# EAGLE design outdoor_module (EAGLE 9.6.2)
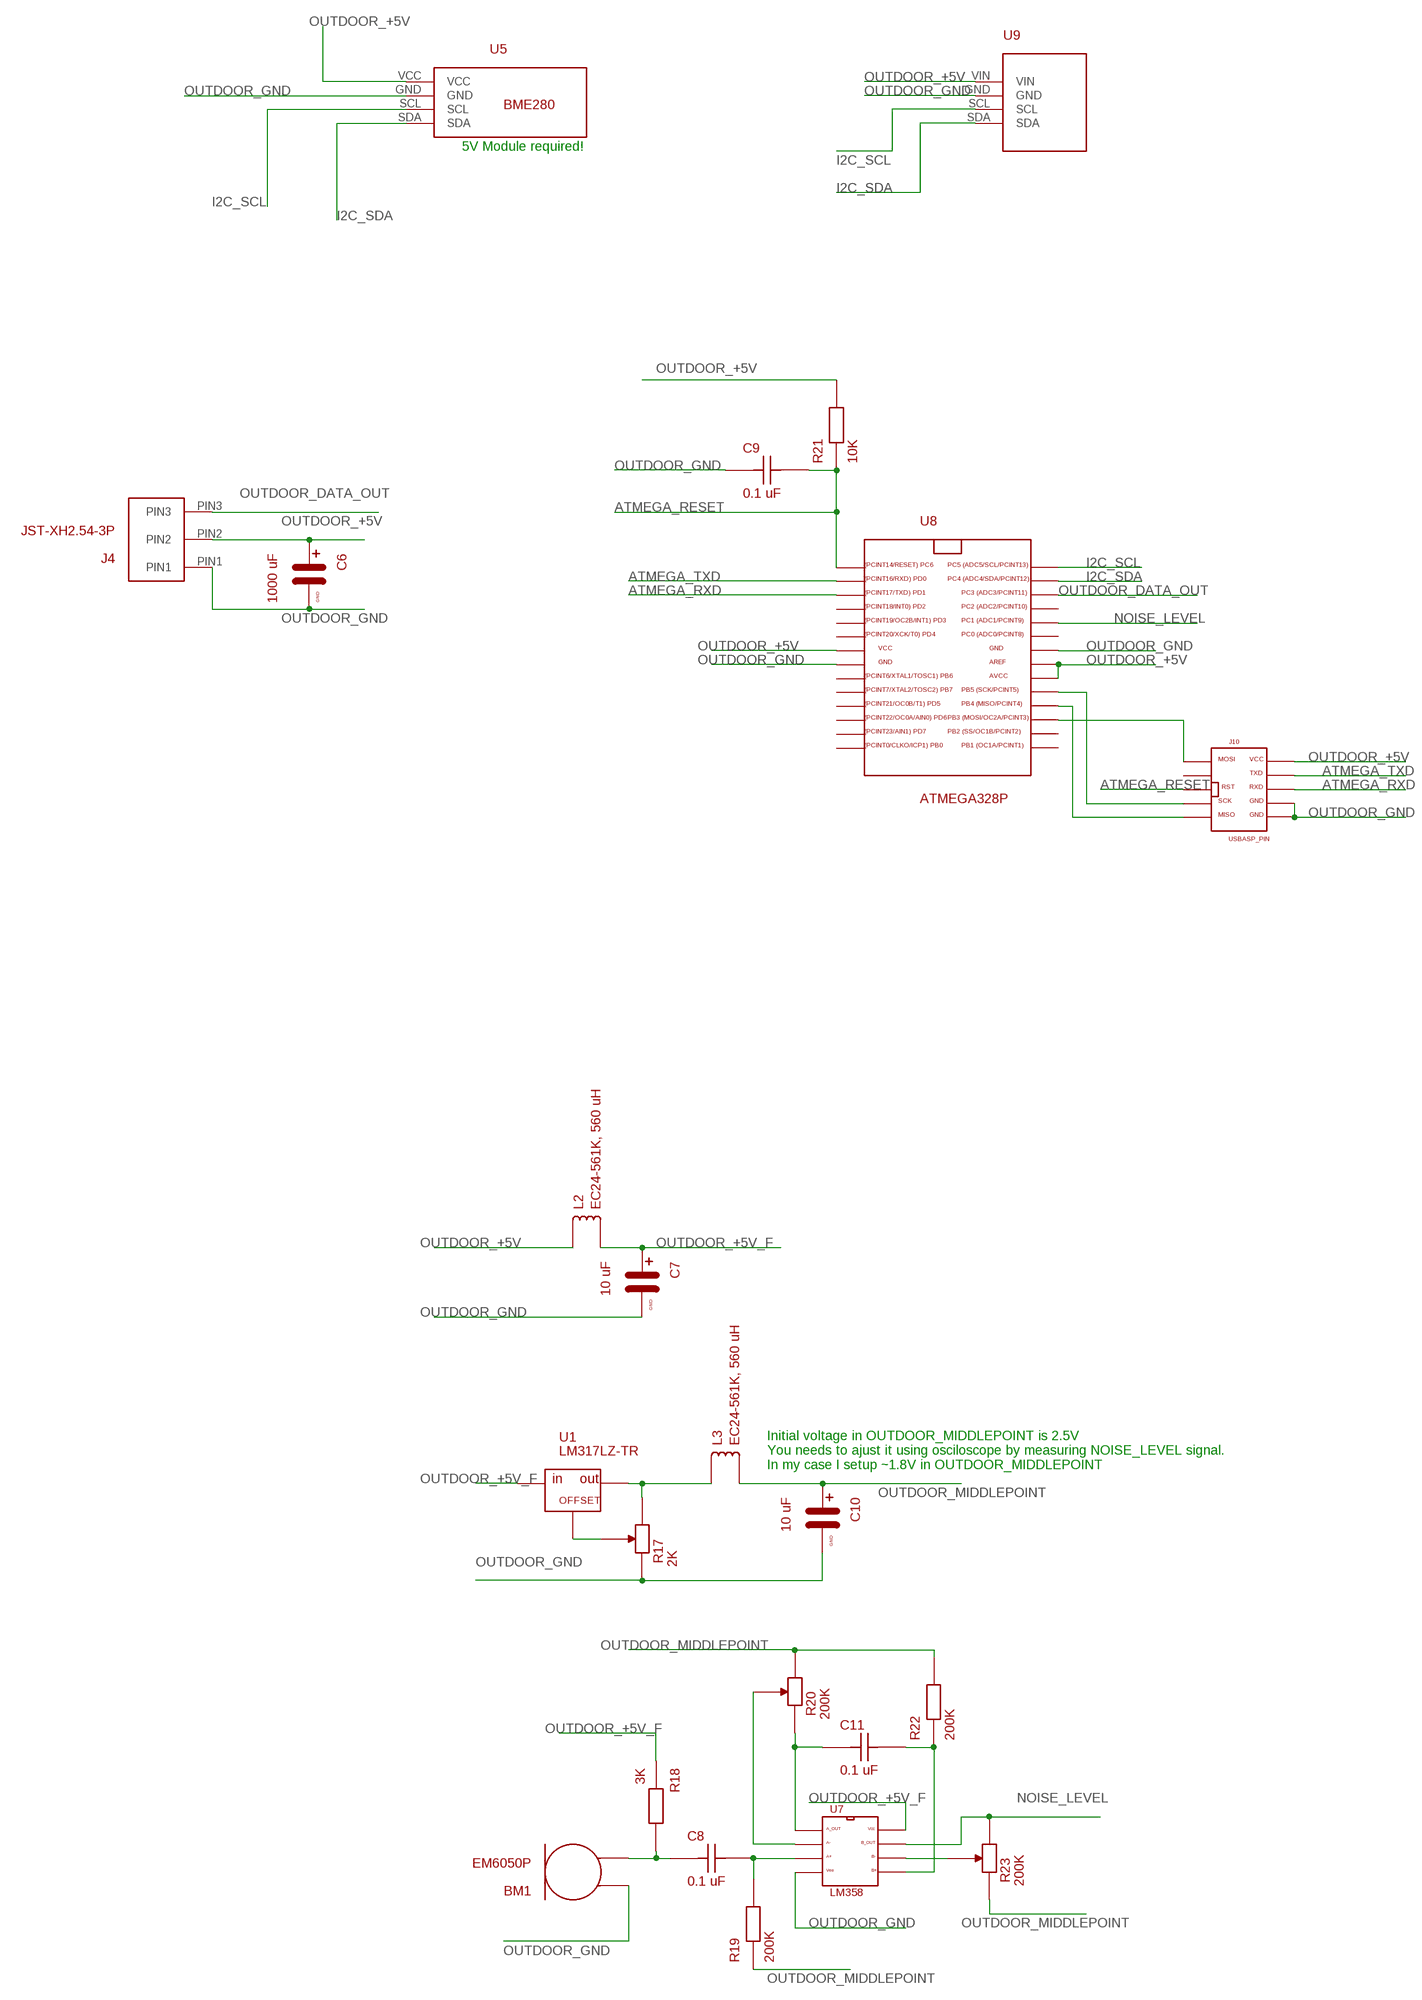
[diagram p0: schematic, sheet 1]

## Parts
BM1  EM6050P  MICROPHONE  [MICROPHONE]
C6  1000 uF  C  [C]
C7  10 uF  C  [C]
C8  0.1 uF  C-1  [C-1]
C9  0.1 uF  C-1  [C-1]
C10  10 uF  C  [C]
C11  0.1 uF  C-1  [C-1]
J4  JST-XH2.54-3P  JST-XH254-3P  [JST-XH254-3P]
J10  USBASP_PIN  [USBASP_PIN]
L2  EC24-561K, 560 uH  LL-EC24  [L-EC24]
L3  EC24-561K, 560 uH  LL-EC24  [L-EC24]
R17  2K  RD  [RD-3362H]
R18  3K  R  [R]
R19  200K  R  [R]
R20  200K  RD3296-Z  [RD-3296Z]
R21  10K  R  [R]
R22  200K  R  [R]
R23  200K  RD3296-Z  [RD-3296Z]
U1  LM317LZ-TR  LM317L  [TO-92]
U5  BMP280 5V module  BME280BME280-CONNECTOR-ONLY  [BME280-CONNECTOR-ONLY]
U7  LM358  [DIP8]
U8  ATMEGA328P  [ATMEGA328P]
U9  GY-SGP30  [GY-SGP30]

## Nets
ATMEGA_RESET: C9.P$2 J10.RST(RESET) R21.P$1 U8.PC6
ATMEGA_RXD: J10.RXD U8.PD1
ATMEGA_TXD: J10.TXD U8.PD0
I2C_SCL: U5.SCL U8.PC5 U9.SCL
I2C_SDA: U5.SDA U8.PC4 U9.SDA
N$14: BM1.P$2 C8.P$1 R18.P$2
N$15: C8.P$2 R19.P$2 U7.PIN_3(A+)
N$17: R17.P3 U1.P3(GND)
N$18: C11.P$1 R20.P1 U7.PIN_1(A_OUT)
N$19: R23.P3 U7.PIN_6(B-)
N$20: C11.P$2 R22.P$1 U7.PIN_5(B+)
N$21: R20.P3 U7.PIN_2(A-)
N$24: J10.MOSI U8.PB3
N$25: J10.MISO U8.PB4
N$26: J10.SCK U8.PB5
NOISE_LEVEL: R23.P2 U7.PIN_7(B_OUT) U8.PC1
OUT: L3.P$1 R17.P2 U1.P2(OUT)
OUTDOOR_+5V: C6.PIN_PLUS J4.PIN2 J10.VCC L2.P$1 R21.P$2 U5.VCC U8.AREF U8.AVCC U8.VCC U9.VIN
OUTDOOR_+5V_F: C7.PIN_PLUS L2.P$2 R18.P$1 U1.P1(IN) U7.PIN_8(VCC)
OUTDOOR_DATA_OUT: J4.PIN3 U8.PC3
OUTDOOR_GND: BM1.P$1 C6.PIN_GND C7.PIN_GND C9.P$1 C10.PIN_GND J4.PIN1 J10.GND J10.GND1 R17.P1 U5.GND U7.PIN_4(VEE) U8.GND U8.GND1 U9.GND
OUTDOOR_MIDDLEPOINT: C10.PIN_PLUS L3.P$2 R19.P$1 R20.P2 R22.P$2 R23.P1
Unconnected: J10.NC1 U8.PB0 U8.PB1 U8.PB2 U8.PB6 U8.PB7 U8.PC0 U8.PC2 U8.PD2 U8.PD3 U8.PD4 U8.PD5 U8.PD6 U8.PD7

## Notes on the sheet
- 5V Module required!
- Initial voltage in OUTDOOR_MIDDLEPOINT is 2.5V
  You needs to ajust it using osciloscope by measuring NOISE_LEVEL signal.
  In my case I setup ~1.8V in OUTDOOR_MIDDLEPOINT

## Library data of the parts
BM1 = my_devices:MICROPHONE
C6 C7 C10 = my_devices:C
C8 C9 C11 = my_devices:C-1
J4 = my_devices:JST-XH254-3P
J10 = my_devices:USBASP_PIN
L2 L3 = my_devices:L
R17 R20 R23 = my_devices:RD
R18 R19 R21 R22 = my_devices:R
U1 = my_devices:LM317L
U5 = my_devices:BME280
U7 = my_devices:LM358
U8 = my_devices:ATMEGA328P
U9 = my_devices:GY-SGP30

## Board
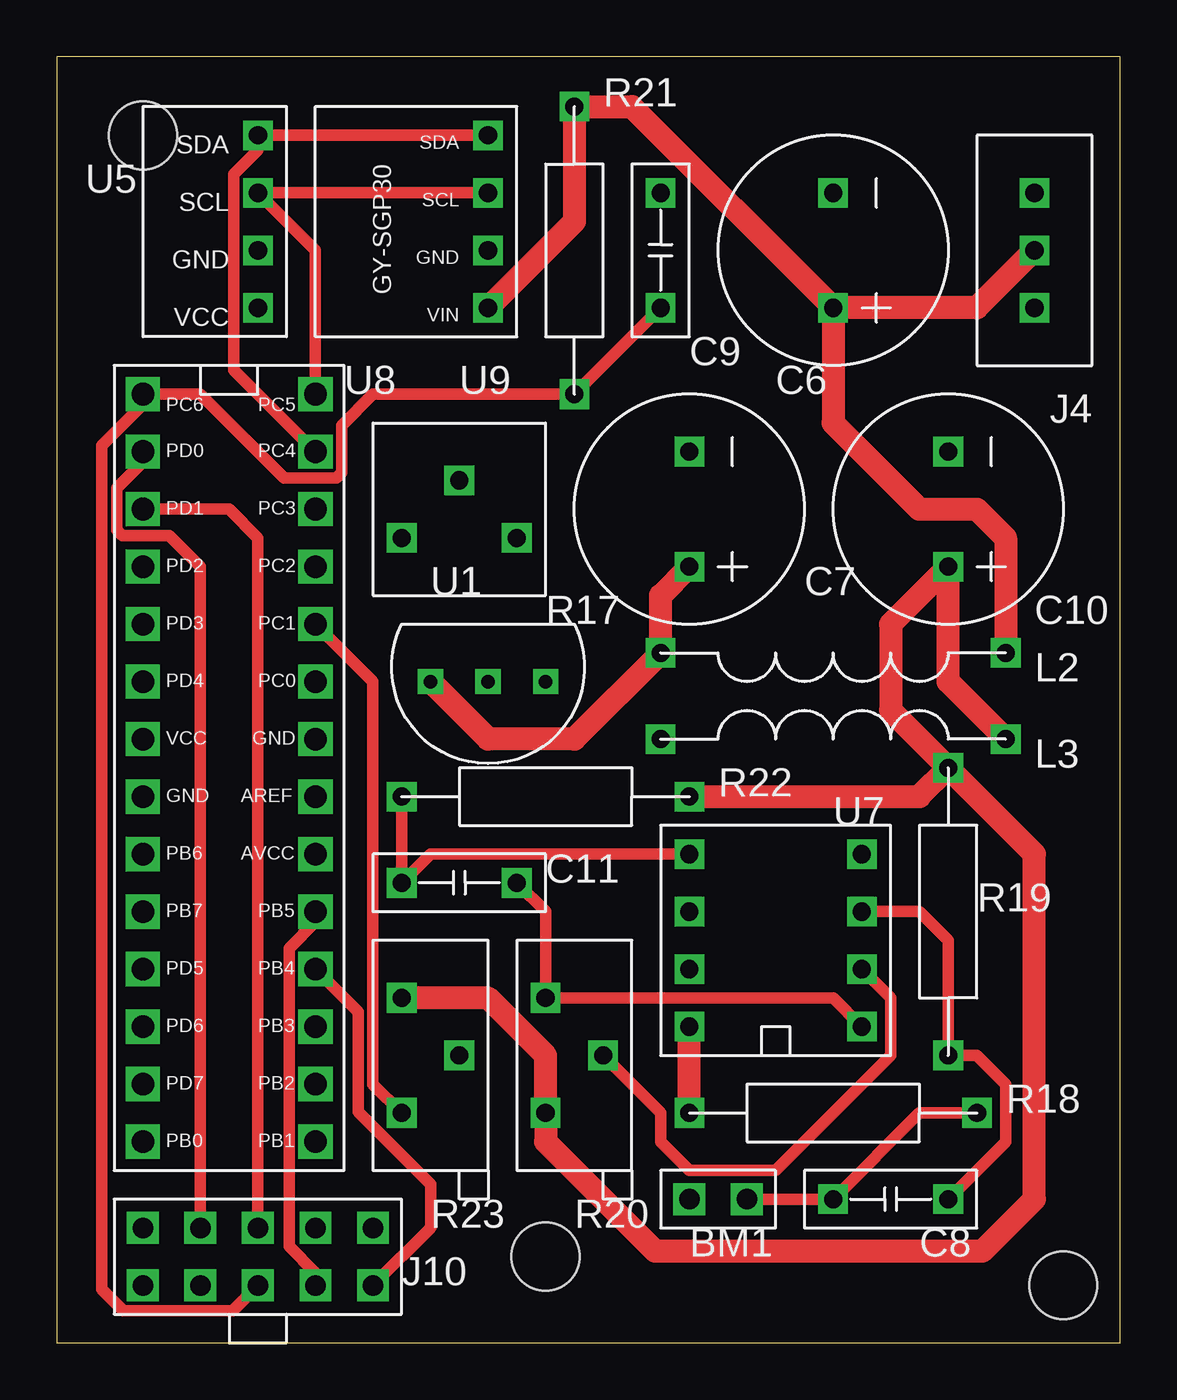
[diagram p1: board, top side]
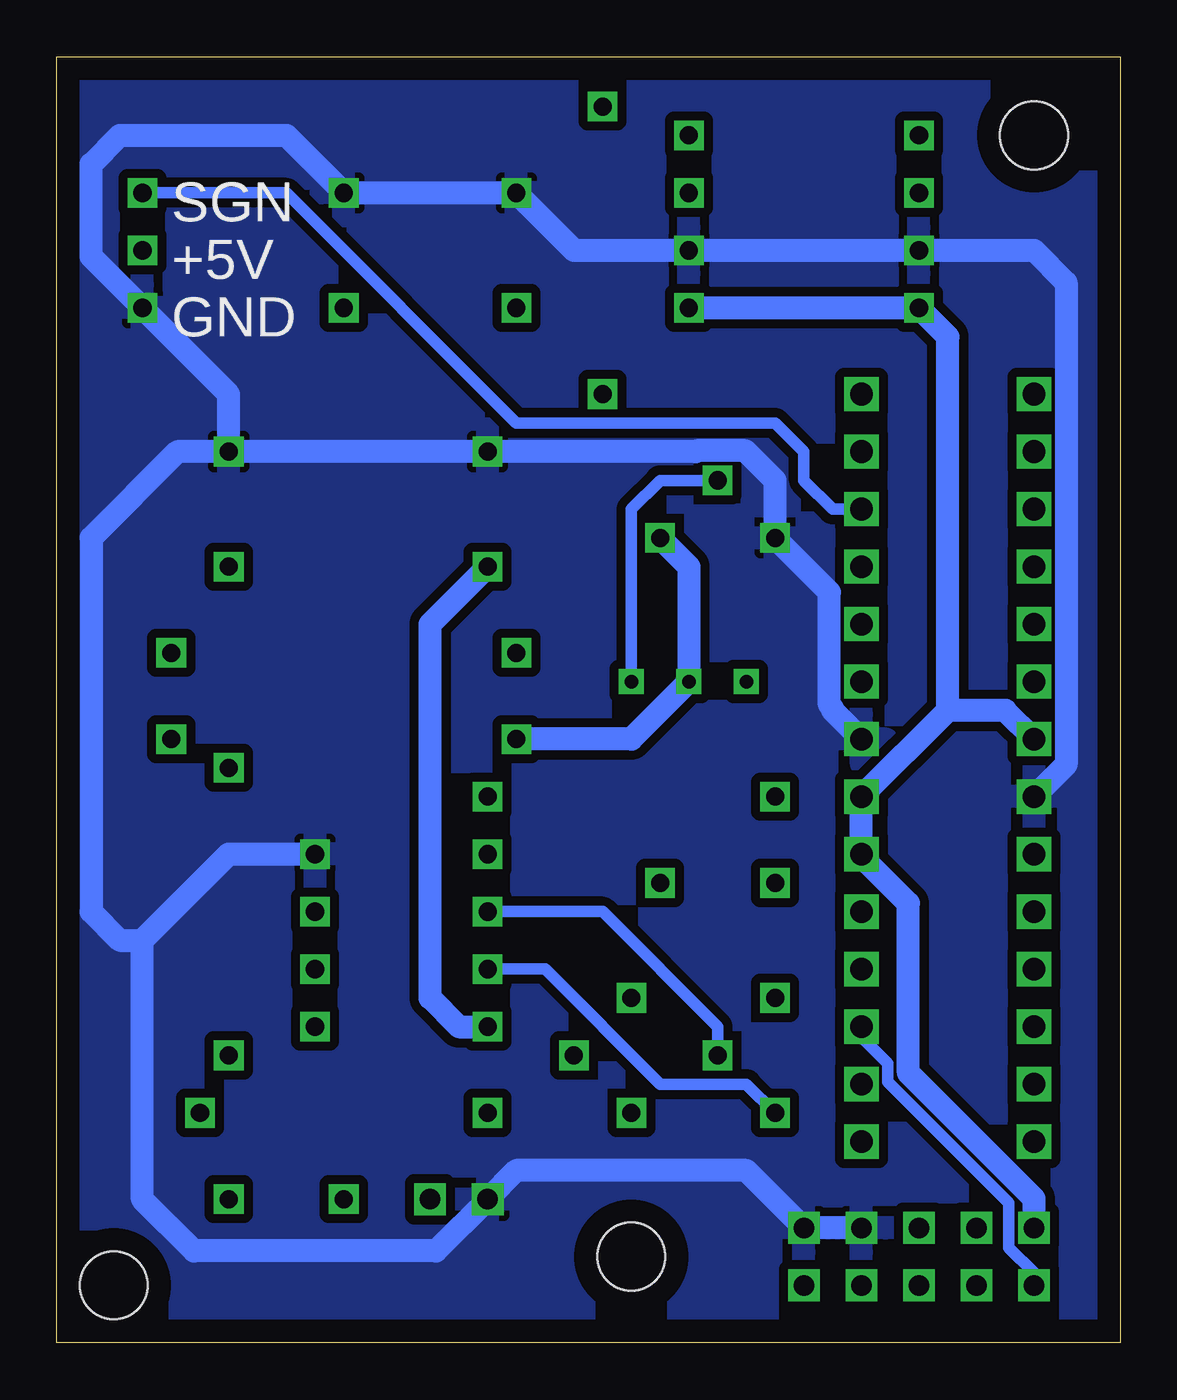
[diagram p2: board, bottom side, seen from below]

Size 46.97 x 56.82 mm. Coordinates in mm from the lower left corner, seen from the top.
Outline: 0,0 46.97,0 46.97,56.82 0,56.82 0,0
Copper layers (1*16): Top 0.035mm / dielectric 1.5mm / Bottom 0.035mm
Design rules "default": minimum track width 6mil, minimum drill 0.35mm, track to track 6mil, track to pad 6mil, pad to pad 6mil, via to via 6mil, smd to smd 6mil, copper to edge 40mil, drill to drill 6mil, minimum pad ring 10mil, minimum via ring 8mil, stop-mask expansion 4mil, vias tented up to drill 0mil, thermal gap 10mil
Holes 3 mm at 3.81,53.34 44.45,2.54 21.59,3.81

### Footprints (pad centres in the part's own frame; a part is rotated, then mirrored left to right if it is on the bottom)
MICROPHONE = drill 0.9 square: P$1 -1.27,0; P$2 1.27,0
C = drill 0.8 square: PIN_GND 2.54,0; PIN_PLUS -2.54,0
C-1 = drill 0.8 square: P$1 -2.54,0; P$2 2.54,0
JST-XH254-3P = drill 0.8 square: PIN1 -2.54,0; PIN2 0,0; PIN3 2.54,0
USBASP_PIN = drill 0.9 square: GND 1.27,-2.54; GND1 1.27,-5.08; MISO -1.27,-5.08; MOSI -1.27,5.08; NC1 -1.27,2.54; RST -1.27,0; RXD 1.27,0; SCK -1.27,-2.54; TXD 1.27,2.54; VCC 1.27,5.08
L-EC24 = drill 0.8 square: P$1 -7.62,0; P$2 7.62,0
RD-3362H = drill 0.8 square: P1 -2.54,-1.27; P2 2.54,-1.27; P3 0,1.27
R = drill 0.8 square: P$1 -6.35,0; P$2 6.35,0
RD-3296Z = drill 0.8 square: P1 -2.54,0; P2 2.54,0; P3 0,2.54
TO-92 = drill 0.6 square: P1 -2.54,0; P2 0,0; P3 2.54,0
BME280-CONNECTOR-ONLY = drill 0.8 square: GND -5.08,1.27; SCL -5.08,-1.27; SDA -5.08,-3.81; VCC -5.08,3.81
DIP8 = drill 0.8 square: PIN_1 -3.81,3.81; PIN_2 -3.81,1.27; PIN_3 -3.81,-1.27; PIN_4 -3.81,-3.81; PIN_5 3.81,-3.81; PIN_6 3.81,-1.27; PIN_7 3.81,1.27; PIN_8 3.81,3.81
ATMEGA328P = drill 1 square: AREF 3.81,-2.54; AVCC 3.81,-5.08; GND -3.81,-2.54; GND1 3.81,0; PB0 -3.81,-17.78; PB1 3.81,-17.78; PB2 3.81,-15.24; PB3 3.81,-12.7; PB4 3.81,-10.16; PB5 3.81,-7.62; PB6 -3.81,-5.08; PB7 -3.81,-7.62; PC0 3.81,2.54; PC1 3.81,5.08; PC2 3.81,7.62; PC3 3.81,10.16; PC4 3.81,12.7; PC5 3.81,15.24; PC6 -3.81,15.24; PD0 -3.81,12.7; PD1 -3.81,10.16; PD2 -3.81,7.62; PD3 -3.81,5.08; PD4 -3.81,2.54; PD5 -3.81,-10.16; PD6 -3.81,-12.7; PD7 -3.81,-15.24; VCC -3.81,0
GY-SGP30 = drill 0.8 square: GND 0,1.27; SCL 0,-1.27; SDA 0,-3.81; VIN 0,3.81

### Placement (x,y rotation side)
BM1  29.21,6.35 0 top
C6  34.29,48.26 90 top
C7  27.94,36.83 90 top
C8  36.83,6.35 0 top
C9  26.67,48.26 270 top
C10  39.37,36.83 90 top
C11  17.78,20.32 180 top
J4  43.18,48.26 90 top
J10  8.89,3.81 90 top
L2  34.29,30.48 180 top
L3  34.29,26.67 0 top
R17  17.78,36.83 0 top
R18  34.29,10.16 0 top
R19  39.37,19.05 270 top
R20  21.59,12.7 270 top
R21  22.86,48.26 90 top
R22  21.59,24.13 0 top
R23  15.24,12.7 270 top
U1  19.05,29.21 0 top
U5  3.81,49.53 180 top
U7  31.75,17.78 180 top
U8  7.62,26.67 0 top
U9  19.05,49.53 180 top

### Tracks (layer width: path | path; a pad name or v marks a point on that pad's centre or on a via)
ATMEGA_RESET
  Top 0.508: C9.P$2 R21.P$1 13.97,41.91 12.59,40.53 12.59,38.45 12.35,38.21 10.05,38.21 6.35,41.91 U8.PC6 3.81,41.45 1.99,39.63 1.99,2.38 2.94,1.43 7.78,1.43 J10.RST
ATMEGA_RXD
  Top 0.508: U8.PD1 7.62,36.83 8.89,35.56 J10.RXD
ATMEGA_TXD
  Top 0.508: J10.TXD 6.35,30.48 6.35,31.75 6.35,34.29 4.97,35.67 2.89,35.67 2.65,35.91 2.65,37.75 3.81,38.91 U8.PD0
I2C_SCL
  Top 0.508: U8.PC5 11.43,48.26 U5.SCL U9.SCL
I2C_SDA
  Top 0.508: U8.PC4 7.83,42.97 7.83,51.62 8.89,52.68 U5.SDA U9.SDA
N$14
  Top 0.508: BM1.P$2 C8.P$1 38.1,10.16 R18.P$2
N$15
  Top 0.508: C8.P$2 41.91,8.89 41.91,11.43 40.64,12.7 R19.P$2 39.37,17.78 38.1,19.05 U7.PIN_3
N$17
  Bottom 0.508: R17.P3 20.32,38.1 21.59,36.83 U1.P3
N$18
  Top 0.508: C11.P$1 21.59,19.05 R20.P1 34.29,15.24 U7.PIN_1
N$19
  Bottom 0.508: R23.P3 17.78,13.97 22.86,19.05 U7.PIN_6
N$20
  Top 0.508: R22.P$1 C11.P$2 16.51,21.59 U7.PIN_5
N$21
  Top 0.508: R20.P3 26.67,10.16 26.67,8.89 27.94,7.62 31.75,7.62 36.83,12.7 36.83,15.24 U7.PIN_2
N$24
  Bottom 0.508: J10.MOSI 3.81,3.1 4.92,4.21 4.92,6.19 10.27,11.54 10.27,12.35 11.43,13.51 U8.PB3
N$25
  Top 0.508: J10.MISO 16.51,5.08 16.51,7.01 13.31,10.21 13.31,14.63 U8.PB4
N$26
  Top 0.508: J10.SCK 11.43,3.1 10.27,4.26 10.27,17.43 11.43,18.59 U8.PB5
NOISE_LEVEL
  Top 0.508: R23.P2 13.97,11.43 13.97,29.21 U8.PC1
  Bottom 0.508: R23.P2 16.51,11.43 20.32,11.43 25.4,16.51 U7.PIN_7
OUT
  Bottom 1.016: L3.P$1 21.59,26.67 U1.P2 19.05,34.29 R17.P2
OUTDOOR_+5V
  Top 1.016: J4.PIN2 40.64,45.72 C6.PIN_PLUS | L2.P$1 41.91,35.56 40.64,36.83 38.1,36.83 34.29,40.64 C6.PIN_PLUS | U9.VIN 22.86,49.53 R21.P$2 25.4,54.61 C6.PIN_PLUS
  Bottom 1.016: U9.VIN U5.VCC 7.62,44.45 7.62,27.94 | 7.62,27.94 U8.AREF U8.AVCC 11.43,21.49 9.36,19.42 9.36,11.92 3.81,6.37 J10.VCC | U8.VCC 5.08,27.94 7.62,27.94
OUTDOOR_+5V_F
  Top 1.016: R18.P$1 U7.PIN_8 | C7.PIN_PLUS 26.67,33.02 L2.P$2 22.86,26.67 19.05,26.67 U1.P1
  Bottom 1.016: U7.PIN_8 29.21,13.97 30.48,15.24 30.48,31.75 C7.PIN_PLUS
OUTDOOR_DATA_OUT
  Bottom 0.508: U8.PC3 12.7,36.83 13.97,38.1 13.97,39.37 15.24,40.64 26.67,40.64 36.83,50.8 J4.PIN3
OUTDOOR_GND
  Bottom 1.016: 43.18,17.78 39.37,21.59 U7.PIN_4 | U8.GND1 12.7,27.94 12.7,28.04 12.84,28.18 12.84,33.16 R17.P1 15.24,38.1 16.55,39.41 18.71,39.41 18.75,39.37 C7.PIN_GND C10.PIN_GND | C10.PIN_GND 41.64,39.37 45.45,35.56 45.45,19.05 44.18,17.78 43.18,17.78 | C10.PIN_GND 39.37,41.91 J4.PIN1 45.45,47.99 45.45,52.07 44.18,53.34 36.83,53.34 C6.PIN_GND C9.P$1 24.13,48.26 U9.GND U5.GND 3.81,48.26 2.4,46.85 2.4,25.54 U8.GND | J10.GND J10.GND1 16.51,7.62 26.67,7.62 BM1.P$1 30.23,4.06 40.89,4.06 43.18,6.35 43.18,17.78
  pour Bottom (isolate 0.406): 1.27,55.88 45.72,55.88 45.72,1.27 1.27,1.27
OUTDOOR_MIDDLEPOINT
  Top 1.016: R22.P$2 38.1,24.13 R19.P$1 | R19.P$1 43.18,21.59 43.18,6.35 40.89,4.06 26.42,4.06 21.59,8.89 R20.P2 21.59,12.7 19.05,15.24 R23.P1 | L3.P$2 39.37,29.21 C10.PIN_PLUS 36.83,31.75 36.83,27.94 R19.P$1

### Text on the board
tPlace: R21 | U5 | C9 | U8 | U9 | C6 | C7 | R17 | C10 | L2 | L3 | R22 | U7 | C11 | R19 | R18 | R23 | R20 | BM1 | C8 | J10
bNames: SGN | +5V | GND